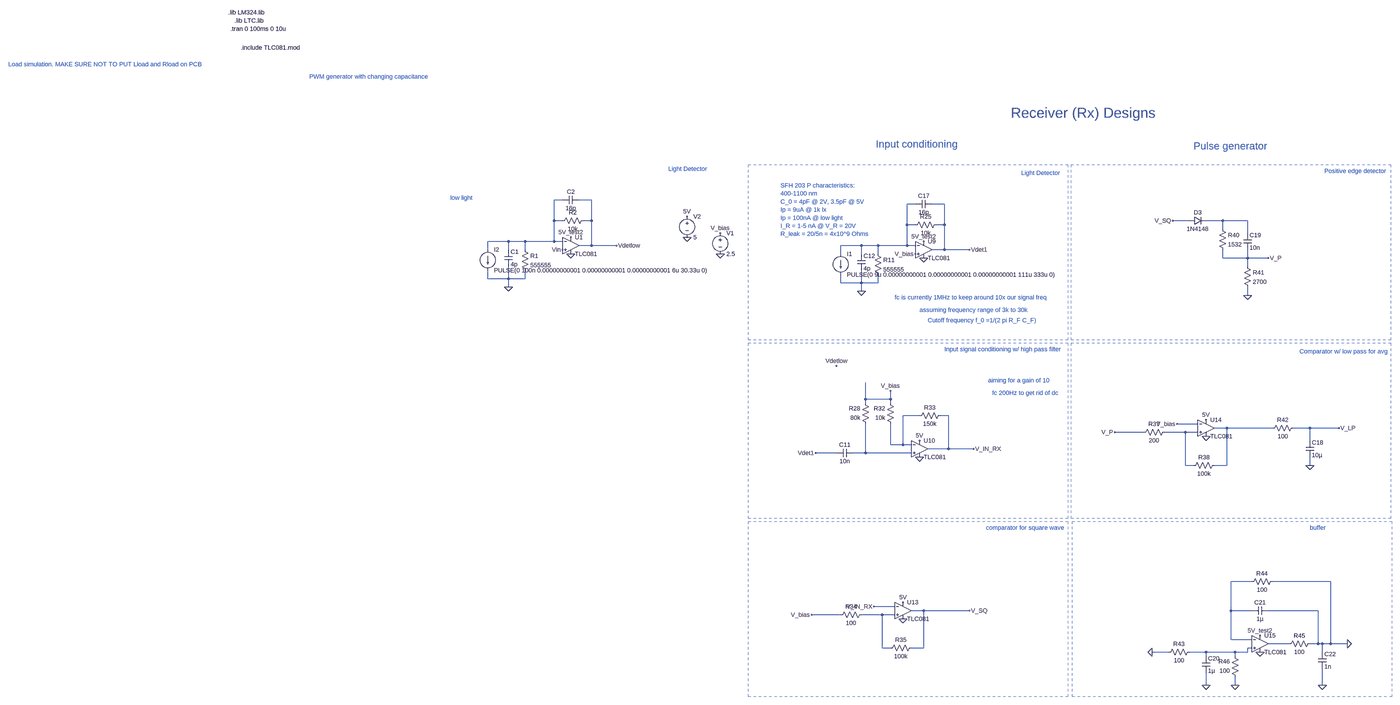
[diagram p0: schematic Receiver part 1.asc, whole sheet]
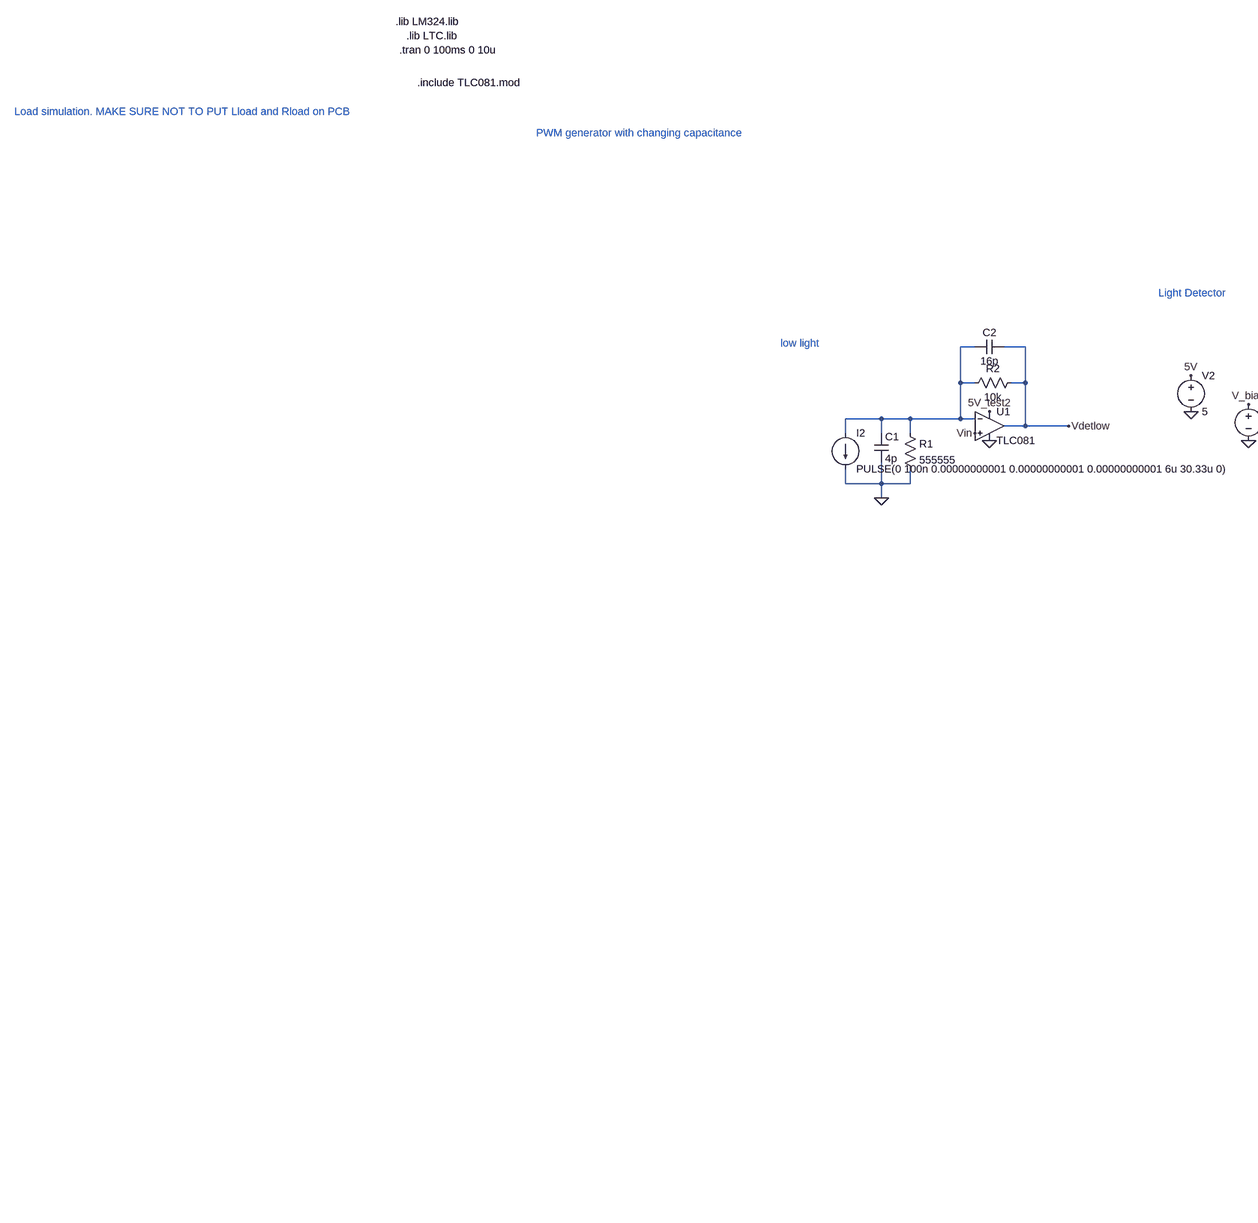
[diagram p1: schematic Receiver part 1.asc, part, row 1 of 1, column 1 of 2]
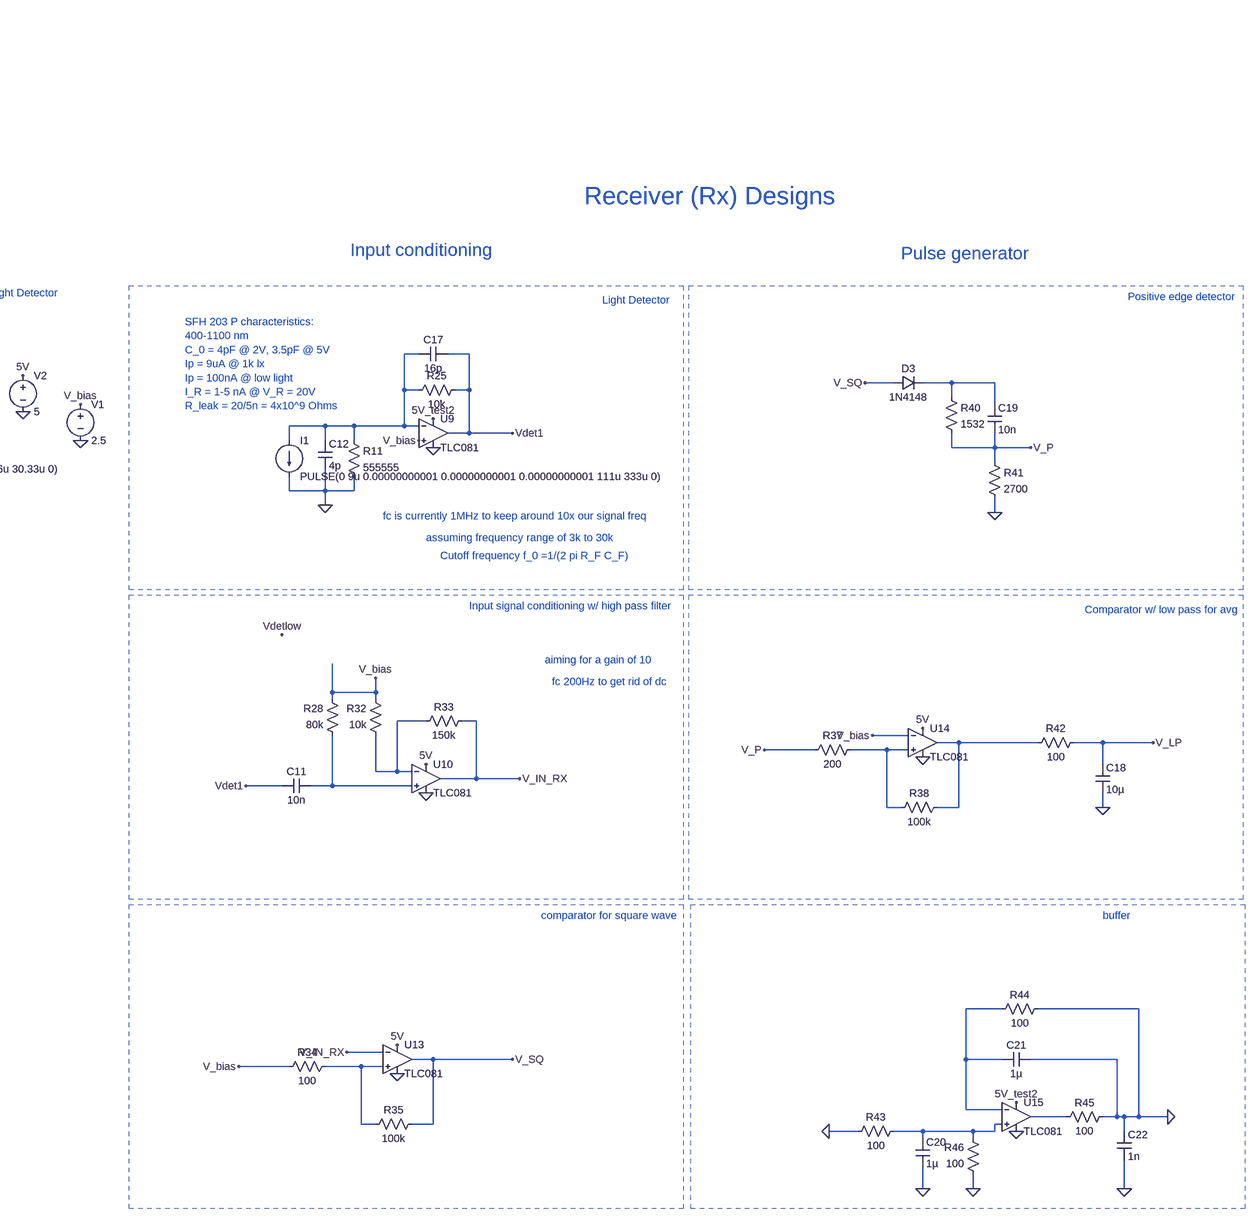
[diagram p2: schematic Receiver part 1.asc, part, row 1 of 1, column 2 of 2]
Receiver part 1.asc, the LTspice schematic file:
Version 4.1
SHEET 1 5208 2800
WIRE 1824 192 1792 192
WIRE 1936 192 1888 192
WIRE 3184 208 3152 208
WIRE 3296 208 3248 208
WIRE 1792 272 1792 192
WIRE 1824 272 1792 272
WIRE 1936 272 1936 192
WIRE 1936 272 1904 272
WIRE 4240 272 4176 272
WIRE 4368 272 4304 272
WIRE 4464 272 4368 272
WIRE 3152 288 3152 208
WIRE 3184 288 3152 288
WIRE 3296 288 3296 208
WIRE 3296 288 3264 288
WIRE 4368 304 4368 272
WIRE 4464 320 4464 272
WIRE 1616 352 1536 352
WIRE 1680 352 1616 352
WIRE 1792 352 1792 272
WIRE 1792 352 1680 352
WIRE 1824 352 1792 352
WIRE 1936 368 1936 272
WIRE 1936 368 1888 368
WIRE 2032 368 1936 368
WIRE 2976 368 2896 368
WIRE 3040 368 2976 368
WIRE 3152 368 3152 288
WIRE 3152 368 3040 368
WIRE 3184 368 3152 368
WIRE 1536 384 1536 352
WIRE 1616 384 1616 352
WIRE 1680 384 1680 352
WIRE 3296 384 3296 288
WIRE 3296 384 3248 384
WIRE 3392 384 3296 384
WIRE 2896 400 2896 368
WIRE 2976 400 2976 368
WIRE 3040 400 3040 368
WIRE 4368 416 4368 384
WIRE 4464 416 4464 384
WIRE 4464 416 4368 416
WIRE 4544 416 4464 416
WIRE 4464 448 4464 416
WIRE 1536 496 1536 464
WIRE 1616 496 1616 448
WIRE 1616 496 1536 496
WIRE 1680 496 1680 464
WIRE 1680 496 1616 496
WIRE 2896 512 2896 480
WIRE 2976 512 2976 464
WIRE 2976 512 2896 512
WIRE 3040 512 3040 480
WIRE 3040 512 2976 512
WIRE 1616 528 1616 496
WIRE 2976 544 2976 512
WIRE 4464 560 4464 528
WIRE 2992 960 2992 896
WIRE 3088 960 3088 928
WIRE 3088 960 2992 960
WIRE 2992 976 2992 960
WIRE 3088 976 3088 960
WIRE 3200 1024 3136 1024
WIRE 3312 1024 3280 1024
WIRE 4272 1056 4192 1056
WIRE 4384 1072 4336 1072
WIRE 4560 1072 4384 1072
WIRE 4704 1072 4640 1072
WIRE 4816 1072 4704 1072
WIRE 4064 1088 3952 1088
WIRE 4224 1088 4144 1088
WIRE 4272 1088 4224 1088
WIRE 4704 1120 4704 1072
WIRE 3088 1136 3088 1056
WIRE 3136 1136 3136 1024
WIRE 3136 1136 3088 1136
WIRE 3168 1136 3136 1136
WIRE 3312 1152 3312 1024
WIRE 3312 1152 3232 1152
WIRE 3408 1152 3312 1152
WIRE 2880 1168 2800 1168
WIRE 2992 1168 2992 1056
WIRE 2992 1168 2944 1168
WIRE 3168 1168 2992 1168
WIRE 4224 1216 4224 1088
WIRE 4256 1216 4224 1216
WIRE 4384 1216 4384 1072
WIRE 4384 1216 4336 1216
WIRE 4704 1216 4704 1184
WIRE 4480 1664 4400 1664
WIRE 4784 1664 4560 1664
WIRE 3104 1760 3024 1760
WIRE 3216 1776 3168 1776
WIRE 3392 1776 3216 1776
WIRE 4400 1776 4400 1664
WIRE 4480 1776 4400 1776
WIRE 4736 1776 4544 1776
WIRE 2896 1792 2784 1792
WIRE 3056 1792 2976 1792
WIRE 3104 1792 3056 1792
WIRE 4400 1888 4400 1776
WIRE 4480 1888 4400 1888
WIRE 4624 1904 4544 1904
WIRE 4736 1904 4736 1776
WIRE 4736 1904 4704 1904
WIRE 4752 1904 4736 1904
WIRE 4784 1904 4784 1664
WIRE 4784 1904 4752 1904
WIRE 4848 1904 4784 1904
WIRE 3056 1920 3056 1792
WIRE 3088 1920 3056 1920
WIRE 3216 1920 3216 1776
WIRE 3216 1920 3168 1920
WIRE 4480 1920 4464 1920
WIRE 4160 1936 4096 1936
WIRE 4304 1936 4240 1936
WIRE 4416 1936 4304 1936
WIRE 4464 1936 4464 1920
WIRE 4464 1936 4416 1936
WIRE 4752 1936 4752 1904
WIRE 4304 1952 4304 1936
WIRE 4416 1952 4416 1936
WIRE 4304 2064 4304 2016
WIRE 4416 2064 4416 2032
WIRE 4752 2064 4752 2000
FLAG 3216 416 0
FLAG 3216 352 5V_test2
FLAG 3200 1184 0
FLAG 3408 1152 V_IN_RX
FLAG 3200 1120 5V
FLAG 3136 1808 0
FLAG 3392 1776 V_SQ
FLAG 3952 1088 V_P
FLAG 4304 1104 0
FLAG 4304 1040 5V
FLAG 4176 272 V_SQ
FLAG 4464 560 0
FLAG 4544 416 V_P
FLAG 4704 1216 0
FLAG 4816 1072 V_LP
FLAG 4512 1936 0
FLAG 4512 1872 5V_test2
FLAG 4416 2064 0
FLAG 4304 2064 0
FLAG 4096 1936 0
FLAG 4752 2064 0
FLAG 4848 1904 0
FLAG 2976 544 0
FLAG 2432 320 V_bias
FLAG 3392 384 Vdet1
FLAG 1856 400 0
FLAG 1856 336 5V_test2
FLAG 1616 528 0
FLAG 1824 384 Vin
FLAG 2432 400 0
FLAG 2304 336 0
FLAG 2304 256 5V
FLAG 3184 400 V_bias
FLAG 3088 928 V_bias
FLAG 2800 1168 Vdet1
FLAG 2784 1792 V_bias
FLAG 3136 1744 5V
FLAG 3024 1760 V_IN_RX
FLAG 2032 368 Vdetlow
FLAG 2880 832 Vdetlow
FLAG 4192 1056 V_bias
SYMBOL opamp2 3216 320 R0
SYMATTR InstName U9
SYMATTR Value TLC081
SYMBOL Cap 2960 400 R0
SYMATTR InstName C12
SYMATTR Value 4p
SYMBOL Res 3024 384 R0
SYMATTR InstName R11
SYMATTR Value 555555
SYMBOL current 2896 400 R0
WINDOW 123 0 0 Left 0
WINDOW 39 0 0 Left 0
SYMATTR InstName I1
SYMATTR Value PULSE(0 9u 0.00000000001 0.00000000001 0.00000000001 111u 333u 0)
SYMBOL Res 3280 272 R90
WINDOW 0 0 56 VBottom 2
WINDOW 3 32 56 VTop 2
SYMATTR InstName R25
SYMATTR Value 10k
SYMBOL Cap 3248 192 R90
WINDOW 0 0 32 VBottom 2
WINDOW 3 32 32 VTop 2
SYMATTR InstName C17
SYMATTR Value 16p
SYMBOL Res 3008 1072 R180
WINDOW 0 36 76 Left 2
WINDOW 3 36 40 Left 2
SYMATTR InstName R28
SYMATTR Value 80k
SYMBOL Res 3104 1072 R180
WINDOW 0 36 76 Left 2
WINDOW 3 36 40 Left 2
SYMATTR InstName R32
SYMATTR Value 10k
SYMBOL opamp2 3200 1088 R0
SYMATTR InstName U10
SYMATTR Value TLC081
SYMBOL Cap 2944 1152 R90
WINDOW 0 0 32 VBottom 2
WINDOW 3 32 32 VTop 2
SYMATTR InstName C11
SYMATTR Value 10n
SYMBOL Res 3296 1008 R90
WINDOW 0 0 56 VBottom 2
WINDOW 3 32 56 VTop 2
SYMATTR InstName R33
SYMATTR Value 150k
SYMBOL opamp2 3136 1712 R0
SYMATTR InstName U13
SYMATTR Value TLC081
SYMBOL Res 2992 1776 R90
WINDOW 0 0 56 VBottom 2
WINDOW 3 32 56 VTop 2
SYMATTR InstName R34
SYMATTR Value 100
SYMBOL Res 3184 1904 R90
WINDOW 0 0 56 VBottom 2
WINDOW 3 32 56 VTop 2
SYMATTR InstName R35
SYMATTR Value 100k
SYMBOL opamp2 4304 1008 R0
SYMATTR InstName U14
SYMATTR Value TLC081
SYMBOL Res 4160 1072 R90
WINDOW 0 0 56 VBottom 2
WINDOW 3 32 56 VTop 2
SYMATTR InstName R37
SYMATTR Value 200
SYMBOL Res 4352 1200 R90
WINDOW 0 0 56 VBottom 2
WINDOW 3 32 56 VTop 2
SYMATTR InstName R38
SYMATTR Value 100k
SYMBOL diode 4240 288 R270
WINDOW 0 32 32 VTop 2
WINDOW 3 0 32 VBottom 2
SYMATTR InstName D3
SYMATTR Value 1N4148
SYMBOL Cap 4448 320 R0
SYMATTR InstName C19
SYMATTR Value 10n
SYMBOL Res 4352 288 R0
SYMATTR InstName R40
SYMATTR Value 1532
SYMBOL Res 4448 432 R0
SYMATTR InstName R41
SYMATTR Value 2700
SYMBOL Res 4656 1056 R90
WINDOW 0 0 56 VBottom 2
WINDOW 3 32 56 VTop 2
SYMATTR InstName R42
SYMATTR Value 100
SYMBOL Cap 4688 1120 R0
SYMATTR InstName C18
SYMATTR Value 10µ
SYMBOL opamp2 4512 1840 R0
SYMATTR InstName U15
SYMATTR Value TLC081
SYMBOL Res 4256 1920 R90
WINDOW 0 0 56 VBottom 2
WINDOW 3 32 56 VTop 2
SYMATTR InstName R43
SYMATTR Value 100
SYMBOL Res 4432 2048 R180
WINDOW 0 36 76 Left 2
WINDOW 3 36 40 Left 2
SYMATTR InstName R46
SYMATTR Value 100
SYMBOL Cap 4288 1952 R0
SYMATTR InstName C20
SYMATTR Value 1µ
SYMBOL Cap 4544 1760 R90
WINDOW 0 0 32 VBottom 2
WINDOW 3 32 32 VTop 2
SYMATTR InstName C21
SYMATTR Value 1µ
SYMBOL Res 4576 1648 R90
WINDOW 0 0 56 VBottom 2
WINDOW 3 32 56 VTop 2
SYMATTR InstName R44
SYMATTR Value 100
SYMBOL Res 4720 1888 R90
WINDOW 0 0 56 VBottom 2
WINDOW 3 32 56 VTop 2
SYMATTR InstName R45
SYMATTR Value 100
SYMBOL Cap 4736 1936 R0
SYMATTR InstName C22
SYMATTR Value 1n
SYMBOL voltage 2432 304 R0
WINDOW 123 0 0 Left 0
WINDOW 39 0 0 Left 0
SYMATTR InstName V1
SYMATTR Value 2.5
SYMBOL opamp2 1856 304 R0
SYMATTR InstName U1
SYMATTR Value TLC081
SYMBOL Cap 1600 384 R0
SYMATTR InstName C1
SYMATTR Value 4p
SYMBOL Res 1664 368 R0
SYMATTR InstName R1
SYMATTR Value 555555
SYMBOL current 1536 384 R0
WINDOW 123 0 0 Left 0
WINDOW 39 0 0 Left 0
SYMATTR InstName I2
SYMATTR Value PULSE(0 100n 0.00000000001 0.00000000001 0.00000000001 6u 30.33u 0)
SYMBOL Res 1920 256 R90
WINDOW 0 0 56 VBottom 2
WINDOW 3 32 56 VTop 2
SYMATTR InstName R2
SYMATTR Value 10k
SYMBOL Cap 1888 176 R90
WINDOW 0 0 32 VBottom 2
WINDOW 3 32 32 VTop 2
SYMATTR InstName C2
SYMATTR Value 16p
SYMBOL voltage 2304 240 R0
WINDOW 123 0 0 Left 0
WINDOW 39 0 0 Left 0
SYMATTR InstName V2
SYMATTR Value 5
TEXT 536 -640 Left 2 !.lib LM324.lib
TEXT 544 -576 Left 2 !.tran 0 100ms 0 10u
TEXT -320 -440 Left 2 ;Load simulation. MAKE SURE NOT TO PUT Lload and Rload on PCB
TEXT 848 -392 Left 2 ;PWM generator with changing capacitance
TEXT 560 -608 Left 2 !.lib LTC.lib
TEXT 584 -504 Left 2 !.include TLC081.mod
TEXT 3032 -24 Left 4 ;Input conditioning
TEXT 3592 88 Left 2 ;Light Detector
TEXT 3296 768 Left 2 ;Input signal conditioning w/ high pass filter
TEXT 3552 -144 Left 5 ;Receiver (Rx) Designs
TEXT 4760 80 Left 2 ;Positive edge detector
TEXT 3456 1456 Left 2 ;comparator for square wave
TEXT 4256 -16 Left 4 ;Pulse generator
TEXT 4664 776 Left 2 ;Comparator w/ low pass for avg
TEXT 2664 136 Left 2 ;SFH 203 P characteristics:\n400-1100 nm\nC_0 = 4pF @ 2V, 3.5pF @ 5V\nIp = 9uA @ 1k lx\nIp = 100nA @ low light\nI_R = 1-5 nA @ V_R = 20V\nR_leak = 20/5n = 4x10^9 Ohms
TEXT 3232 656 Left 2 ;Cutoff frequency f_0 =1/(2 pi R_F C_F)
TEXT 4704 1456 Left 2 ;buffer
TEXT 3200 616 Left 2 ;assuming frequency range of 3k to 30k
TEXT 3104 568 Left 2 ;fc is currently 1MHz to keep around 10x our signal freq
TEXT 2232 72 Left 2 ;Light Detector
TEXT 1392 184 Left 2 ;low light
TEXT 3464 888 Left 2 ;aiming for a gain of 10
TEXT 3480 936 Left 2 ;fc 200Hz to get rid of dc
RECTANGLE Normal 2540 56 3772 732 2
RECTANGLE Normal 2540 744 3772 1420 2
RECTANGLE Normal 3784 56 5016 732 2
RECTANGLE Normal 3784 744 5016 1420 2
RECTANGLE Normal 2540 1432 3772 2108 2
RECTANGLE Normal 3788 1432 5020 2108 2

The netlist it stands for:
* Receiver part 1.asc
X§U9 V_bias N002 5V_test2 0 Vdet1 TLC081  ; pins In+ In- V+ V- OUT
C12 N002 0 4p
R11 N002 0 555555
I1 N002 0 PULSE(0 9u 0.00000000001 0.00000000001 0.00000000001 111u 333u 0)
R25 Vdet1 N002 10k
C17 Vdet1 N002 16p
R28 N007 V_bias 80k
R32 N004 V_bias 10k
X§U10 N007 N004 5V 0 V_IN_RX TLC081  ; pins In+ In- V+ V- OUT
C11 N007 Vdet1 10n
R33 V_IN_RX N004 150k
X§U13 N009 V_IN_RX 5V 0 V_SQ TLC081  ; pins In+ In- V+ V- OUT
R34 N009 V_bias 100
R35 V_SQ N009 100k
X§U14 N006 V_bias 5V 0 N005 TLC081  ; pins In+ In- V+ V- OUT
R37 N006 V_P 200
R38 N005 N006 100k
D3 V_SQ N003 1N4148
C19 N003 V_P 10n
R40 N003 V_P 1532
R41 V_P 0 2700
R42 V_LP N005 100
C18 V_LP 0 10µ
X§U15 N011 N008 5V_test2 0 N010 TLC081  ; pins In+ In- V+ V- OUT
R43 N011 0 100
R46 0 N011 100
C20 N011 0 1µ
C21 0 N008 1µ
R44 0 N008 100
R45 0 N010 100
C22 0 0 1n
V1 V_bias 0 2.5
X§U1 Vin N001 5V_test2 0 Vdetlow TLC081  ; pins In+ In- V+ V- OUT
C1 N001 0 4p
R1 N001 0 555555
I2 N001 0 PULSE(0 100n 0.00000000001 0.00000000001 0.00000000001 6u 30.33u 0)
R2 Vdetlow N001 10k
C2 Vdetlow N001 16p
V2 5V 0 5
.model D D
.lib standard.dio
.lib LM324.lib
.tran 0 100ms 0 10u
* Load simulation. MAKE SURE NOT TO PUT Lload and Rload on PCB
* PWM generator with changing capacitance
.lib LTC.lib
.include TLC081.mod
* Input conditioning
* Light Detector
* Input signal conditioning w/ high pass filter
* Receiver (Rx) Designs
* Positive edge detector
* comparator for square wave
* Pulse generator
* Comparator w/ low pass for avg
* SFH 203 P characteristics:
* 400-1100 nm
* C_0 = 4pF @ 2V, 3.5pF @ 5V
* Ip = 9uA @ 1k lx
* Ip = 100nA @ low light
* I_R = 1-5 nA @ V_R = 20V
* R_leak = 20/5n = 4x10^9 Ohms
* Cutoff frequency f_0 =1/(2 pi R_F C_F)
* buffer
* assuming frequency range of 3k to 30k
* fc is currently 1MHz to keep around 10x our signal freq
* Light Detector
* low light
* aiming for a gain of 10
* fc 200Hz to get rid of dc
.backanno
.end